# EasyEDA schematic schematic.json

## Parts
C1  100nF  [0]
C2  100nF  [0]
H1  DS1023-2*2SF11  [0]
H2  DS1023-2*2SF11  [0]
H3  DS1023-2*2SF11  [0]
H4  DS1023-2*2SF11  [0]
P1  2.54-1*2P母  [0]
P2  2.54-1*2P母  [0]
P3  2.54-1*6P母  [0]
P4  2.54-1*6P母  [0]
P5  2.54-1*6P母  [0]
P6  2.54-1*6P母  [0]
P7  2.54-1*6P母  [0]
P8  2.54-1*6P母  [0]
P9  2.54-1*6P母  [0]
P10  2.54-1*6P母  [0]
P11  2.54-1*6P母  [0]
R1  220Ω  [0]
R2  220Ω  [0]
R3  220Ω  [0]
R4  220Ω  [0]
R5  220Ω  [0]
SK1  IC-14P窄  [0]
SK2  IC-14P窄  [0]
SK3  IC-14P窄  [0]
SK4  IC-14P窄  [0]
TP1  Test-Point  [0]
TP2  Test-Point  [0]
TP3  Test-Point  [0]
TP4  Test-Point  [0]
U1  LM7805D2TRG  [0]
U2  A-SL686W1D-E03-4T  [0]
U3  A-SL686W1D-E03-4T  [0]
U4  A-SL686W1D-E03-4T  [0]
U5  A-SL686W1D-E03-4T  [0]
U6  A-SL686W1D-E03-4T  [0]
U7  SS12D10G5  [0]
U8  SS12D10G5  [0]
U9  SS12D10G5  [0]
U10  SS12D10G5  [0]
U11  SS12D10G5  [0]
U12  SS12D10G5  [0]

## Library data of the parts
C1 C2 = -: Capacitance: Tolerance:-20%+80% Tolerance:-20%+80% Voltage Rated: Temperature Coefficient:; Symbol: 1206F104Z500; Device: 1206F104Z500CT; Supplier: LCSC; Manufacturer: Walsin(华新科); Manufacturer Part: 1206F104Z500CT; Supplier Part: C152824; JLCPCB Part Class: Extended Part; LCSC Part Name: 100nF -20%+80% 50V; Supplier Footprint: 1206; Datasheet: https://atta.szlcsc.com/upload/public/pdf/source/20191217/C469650_84AD5C6F618CF4AC0C6D987F2E8FE6F8.pdf; Add into BOM: yes; Convert to PCB: yes; Tolerance: -20%+80%
H1-H4 = -: Holes Structure:2x2P Pitch:2.54mm Row Spacing:2.54mm Mounting Type:Straight Number of Rows:双排 Number of Holes:4P Insulation Height:- Contact Material:- Contact Plating:Gold; Symbol: Header-Female-2.54_2x2; Supplier: LCSC; Manufacturer: CONNFLY; Supplier Part: C92273; JLCPCB Part Class: Extended Part; LCSC Part Name: 间距:2.54mm 2x2P 直插 黑色; Supplier Footprint: 插件,P=2.54mm; Datasheet: https://atta.szlcsc.com/upload/public/pdf/source/20170925/C132132_1506321659018990428.pdf; Add into BOM: yes; Convert to PCB: yes; Holes Structure: 2x2P; Pitch: 2.54mm; Row Spacing: 2.54mm; Mounting Type: Straight; Number of Rows: 双排; Number of Holes: 4P; Contact Plating: Gold
P1 P2 = -: Holes Structure:1x2P Pitch:2.54mm Row Spacing:- Mounting Type:Straight Number of Rows:Plugin Number of Holes:2P Insulation Height:- Contact Material:- Contact Plating:-; Symbol: Header-Female-2.54_1x2; Supplier: LCSC; Manufacturer: BOOMELE(博穆精密); Supplier Part: C49661; JLCPCB Part Class: Extended Part; LCSC Part Name: 间距:2.54mm 1x2P 直插; Supplier Footprint: 插件,P=2.54mm; Datasheet: https://atta.szlcsc.com/upload/public/pdf/source/20210301/C2718488_F4427B881E42CAA8DDB0B1C12B3A522C.pdf; Add into BOM: yes; Convert to PCB: yes; Holes Structure: 1x2P; Pitch: 2.54mm; Mounting Type: Straight; Number of Rows: Plugin; Number of Holes: 2P
P3-P11 = -: Holes Structure:1x6P Pitch:2.54mm Row Spacing:- Mounting Type:Straight Number of Rows:Plugin Number of Holes:6P Insulation Height:- Contact Material:- Contact Plating:-; Symbol: Header-Female-2.54_1x6; Supplier: LCSC; Manufacturer: BOOMELE(博穆精密); Supplier Part: C40877; JLCPCB Part Class: Extended Part; LCSC Part Name: 间距:2.54mm 1x6P 直插; Supplier Footprint: 插件,P=2.54mm; Datasheet: https://atta.szlcsc.com/upload/public/pdf/source/20210301/C2718488_F4427B881E42CAA8DDB0B1C12B3A522C.pdf; Add into BOM: yes; Convert to PCB: yes; Holes Structure: 1x6P; Pitch: 2.54mm; Mounting Type: Straight; Number of Rows: Plugin; Number of Holes: 6P
R1-R5 = -: Type:Thick Film Resistors Resistance: Tolerance:±1% Tolerance:±1% Power(Watts): Overload Voltage (Max): Temperature Coefficient:±100ppm/℃ Temperature Coefficient:±100ppm/℃ Operating Temperature Range:-55℃+155℃ Operating Temperature Range:-55℃+155℃; Symbol: 0603WAF2200T5E; Device: 0603WAF2200T5E; Supplier: LCSC; Manufacturer: UNI-ROYAL(厚声); Manufacturer Part: 0603WAF2200T5E; Supplier Part: C22962; JLCPCB Part Class: Basic Part; LCSC Part Name: 220Ω ±1% 100mW 厚膜电阻; Supplier Footprint: 0603; Datasheet: https://atta.szlcsc.com/upload/public/pdf/source/20200306/C422600_1E6D84923E4A46A82E41ADD87F860B5C.pdf; Add into BOM: yes; Convert to PCB: yes; Type: Thick Film Resistors; Tolerance: ±1%; Temperature Coefficient: ±100ppm/℃; Operating Temperature Range: -55℃+155℃
SK1-SK4 = -: IC Type:DIP Pitch:2.54mm Row Spacing:7.62mm Number of Positions:14P Contact Plating:-; Symbol: IC seat 14P; Supplier: LCSC; Supplier Part: C2325; Manufacturer: BOOMELE(博穆精密); JLCPCB Part Class: Extended Part; LCSC Part Name: 间距2.54mm P数:14P; Supplier Footprint: DIP-14; Datasheet: https://atta.szlcsc.com/upload/public/pdf/source/20151118/1457707579760.pdf; Add into BOM: yes; Convert to PCB: yes; IC Type: DIP; Pitch: 2.54mm; Row Spacing: 7.62mm; Number of Positions: 14P
TP1-TP4 = -: Test Point 测试点; Add into BOM: yes; Convert to PCB: yes
U1 = -: Output Voltage:5V Output Voltage:5V MAX Output Current:1A; LCSC Part Name: 输出5V 1A; Supplier Part: C5145272; Manufacturer: HGC(深圳汉芯); Supplier Footprint: TO-263-2L; JLCPCB Part Class: Extended Part; Datasheet: https://atta.szlcsc.com/upload/public/pdf/source/20221013/97779BADA09E5A3934D7B63AF44D621F.pdf; Supplier: LCSC; Add into BOM: yes; Convert to PCB: yes; Output Voltage: 5V; MAX Output Current: 1A
U2-U6 = -: Emitted Color:White Forward Voltage (VF):2.7V3.5V Forward Voltage (VF):2.7V3.5V Power Dissipation:105mW Forward Current:30mA Lens Color:雾状黄透镜 Luminous Intensity:3600mcd Luminous Intensity:3600mcd Viewing Angle:120° Mounting Sytle:正贴 Operating Temperatur; Supplier Part: C5355447; Manufacturer: Amicc(欧密格光电); Supplier Footprint: SMD,1.6x2mm; JLCPCB Part Class: Extended Part; Datasheet: https://atta.szlcsc.com/upload/public/pdf/source/20230209/C3AA2C3BF583E4A2DB0371A789DB239F.pdf; Supplier: LCSC; Add into BOM: yes; Convert to PCB: yes; Emitted Color: White; Forward Voltage (VF): 2.7V3.5V; Power Dissipation: 105mW; Forward Current: 30mA; Lens Color: 雾状黄透镜; Luminous Intensity: 3600mcd; Viewing Angle: 120°; Mounting Sytle: 正贴; Operating Temperature: -40℃+85℃
U7-U12 = -: Circuit:SPDT Switch Length:12.7mm Switch Width:6.7mm Mounting Style:Straight Current Rating (DC):2A Voltage Rating (DC):125V Mechanical Life:3千次 Operating Temperature:-25℃+70℃ Operating Temperature:-25℃+70℃; LCSC Part Name: 两档立式插件 3脚拨动开关 柄长5.0mm; Supplier Part: C7431054; Manufacturer: SHOU HAN(首韩); Supplier Footprint: 插件; JLCPCB Part Class: Extended Part; Datasheet: https://atta.szlcsc.com/upload/public/pdf/source/20231130/7A3DB6A149BF0A1DCFFE64FFC07FE434.pdf; Supplier: LCSC; Add into BOM: yes; Convert to PCB: yes; Circuit: SPDT; Switch Length: 12.7mm; Switch Width: 6.7mm; Mounting Style: Straight; Current Rating (DC): 2A; Voltage Rating (DC): 125V; Mechanical Life: 3千次; Operating Temperature: -25℃+70℃

## Nets
GND: C1.1 C2.1 P1.1 P2.2 SK1.7 SK2.7 SK3.7 SK4.7 TP1.1 TP4.1 U1.2(GND) U2.1(K) U3.1(K) U4.1(K) U5.1(K) U6.1(K)
NET1: C2.2 P2.1 R1.1 SK1.14 SK2.14 SK3.14 SK4.14 TP3.1 U1.3(VOUT) U7.2 U8.2 U9.2 U10.2 U11.2 U12.2
Net-(C1-2): C1.2 P1.2 TP2.1 U1.1(VCC)
Net-(H1-1): H1.1 H1.2 H1.3 H1.4 R2.2
Net-(H2-1): H2.1 H2.2 H2.3 H2.4 R3.2
Net-(H3-1): H3.1 H3.2 H3.3 H3.4 R4.2
Net-(H4-1): H4.1 H4.2 H4.3 H4.4 R5.2
Net-(P3-1): P3.1 SK1.13
Net-(P3-2): P3.2 SK1.12
Net-(P3-3): P3.3 SK1.11
Net-(P3-4): P3.4 SK1.10
Net-(P3-5): P3.5 SK1.9
Net-(P3-6): P3.6 SK1.8
Net-(P4-1): P4.1 SK2.13
Net-(P4-2): P4.2 SK2.12
Net-(P4-3): P4.3 SK2.11
Net-(P4-4): P4.4 SK2.10
Net-(P4-5): P4.5 SK2.9
Net-(P4-6): P4.6 SK2.8
Net-(P5-1): P5.1 SK4.13
Net-(P5-2): P5.2 SK4.12
Net-(P5-3): P5.3 SK4.11
Net-(P5-4): P5.4 SK4.10
Net-(P5-5): P5.5 SK4.9
Net-(P5-6): P5.6 SK4.8
Net-(P6-1): P6.1 SK3.13
Net-(P6-2): P6.2 SK3.12
Net-(P6-3): P6.3 SK3.11
Net-(P6-4): P6.4 SK3.10
Net-(P6-5): P6.5 SK3.9
Net-(P6-6): P6.6 SK3.8
Net-(P7-1): P7.1 SK1.6
Net-(P7-2): P7.2 SK1.5
Net-(P7-3): P7.3 SK1.4
Net-(P7-4): P7.4 SK1.3
Net-(P7-5): P7.5 SK1.2
Net-(P7-6): P7.6 SK1.1
Net-(P8-1): P8.1 SK2.6
Net-(P8-2): P8.2 SK2.5
Net-(P8-3): P8.3 SK2.4
Net-(P8-4): P8.4 SK2.3
Net-(P8-5): P8.5 SK2.2
Net-(P8-6): P8.6 SK2.1
Net-(P9-1): P9.1 SK3.6
Net-(P9-2): P9.2 SK3.5
Net-(P9-3): P9.3 SK3.4
Net-(P9-4): P9.4 SK3.3
Net-(P9-5): P9.5 SK3.2
Net-(P9-6): P9.6 SK3.1
Net-(P10-1): P10.1 SK4.6
Net-(P10-2): P10.2 SK4.5
Net-(P10-3): P10.3 SK4.4
Net-(P10-4): P10.4 SK4.3
Net-(P10-5): P10.5 SK4.2
Net-(P10-6): P10.6 SK4.1
Net-(P11-1): P11.1 U12.3
Net-(P11-2): P11.2 U11.3
Net-(P11-3): P11.3 U10.3
Net-(P11-4): P11.4 U9.3
Net-(P11-5): P11.5 U8.3
Net-(P11-6): P11.6 U7.3
Net-(R1-2): R1.2 U2.2(A)
Net-(R2-1): R2.1 U3.2(A)
Net-(R3-1): R3.1 U4.2(A)
Net-(R4-1): R4.1 U5.2(A)
Net-(R5-1): R5.1 U6.2(A)

Not connected (* = marked no-connect by the designer): U7 1; U8 1; U9 1; U10 1; U11 1; U12 1

## Notes on the sheet
- 1
- 2
- 3
- 4
- 5
- 6
- A
- A
- B
- B
- C
- C
- Main
- Update Date
- 2024-06-26
- Schematic
- Create Date
- 2024-06-25
- Page
- P1
- Part Number
- ED-100
- Drawn
- EasyEDA
- Reviewed
- EasyEDA
- InnovatED pcb base
- D
- D
- VER
- SIZE
- 1
- 1
- PAGE
- OF
- V1.0
- A4
- InnovatED
- 1
- 2
- 3
- 4
- 5
- 6
